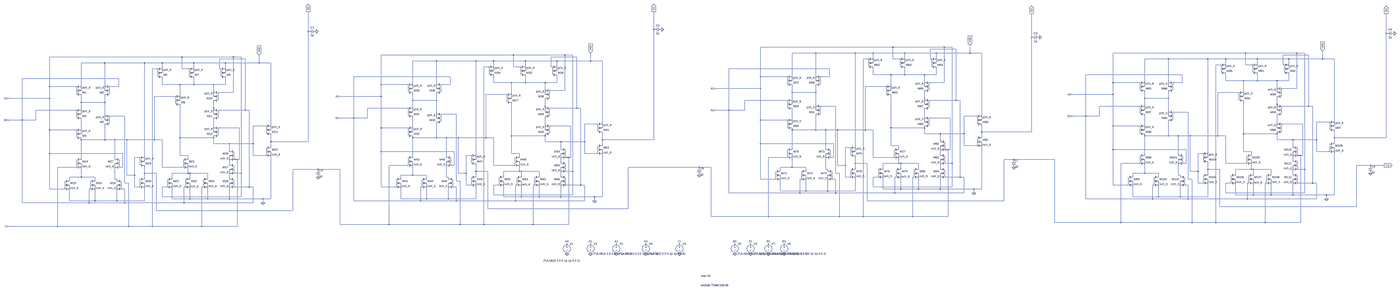
[diagram p0: schematic design_1.asc, whole sheet]
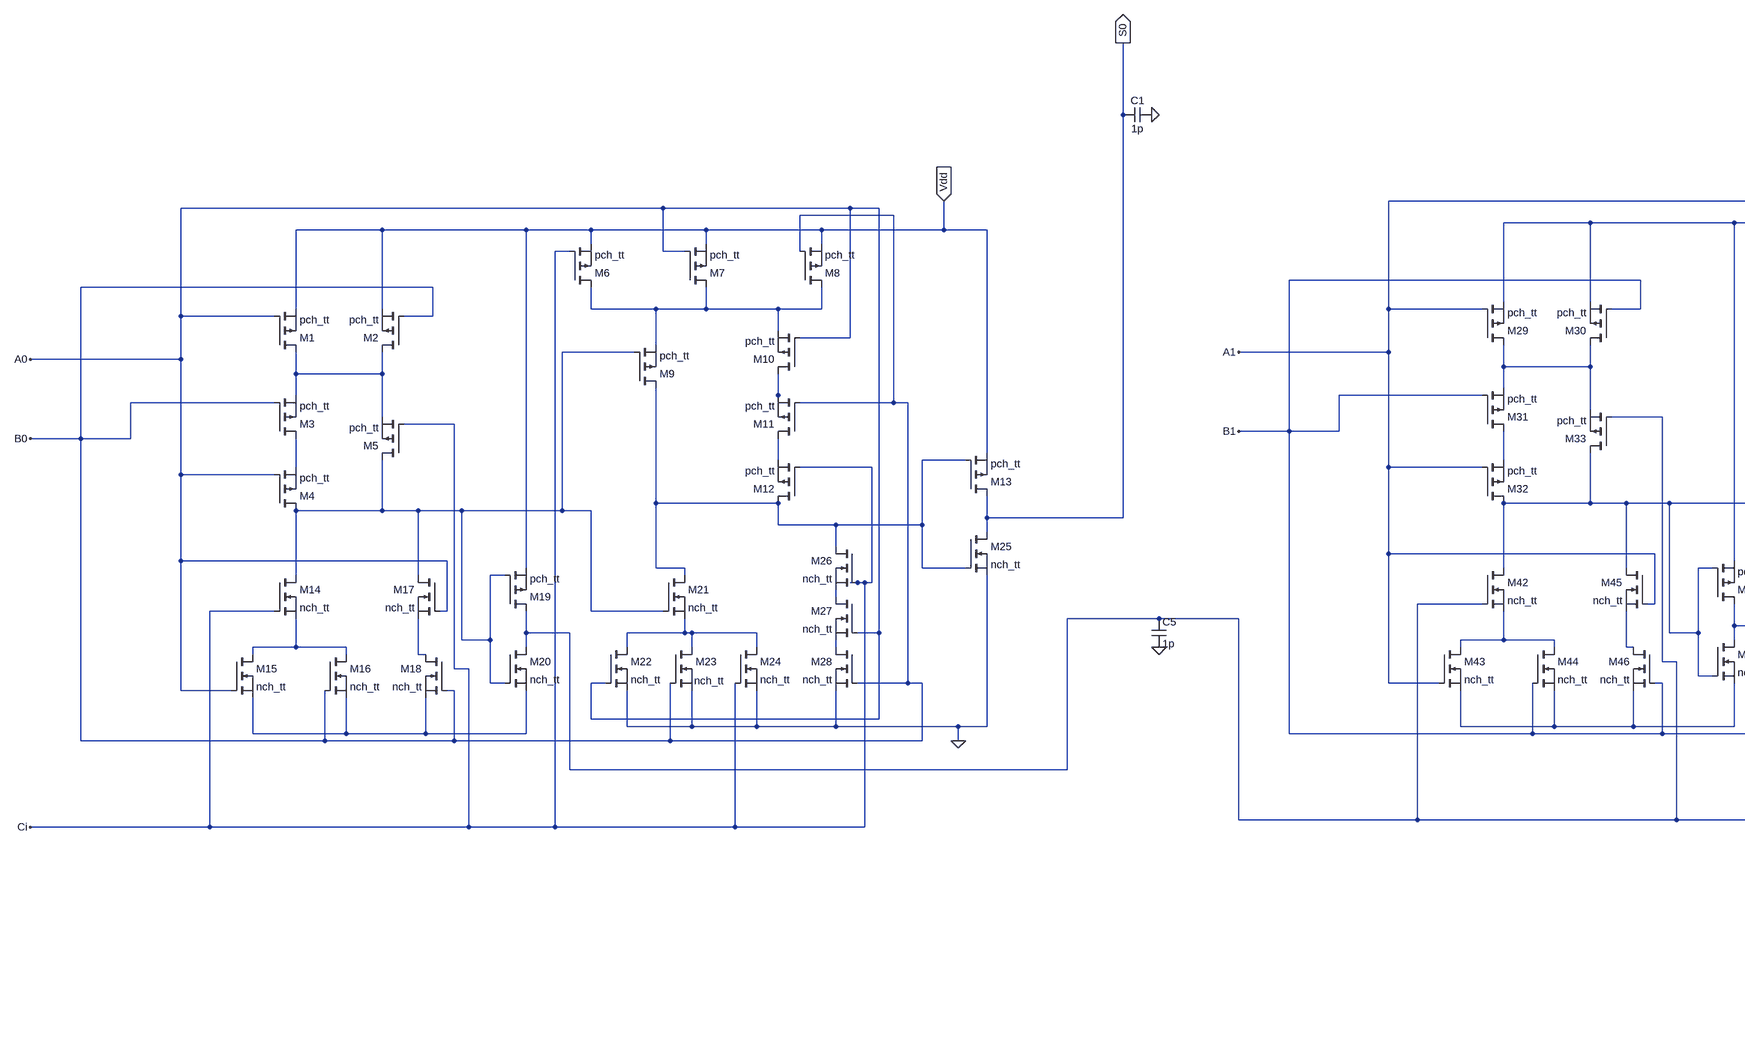
[diagram p1: schematic design_1.asc, part, row 1 of 1, column 1 of 3]
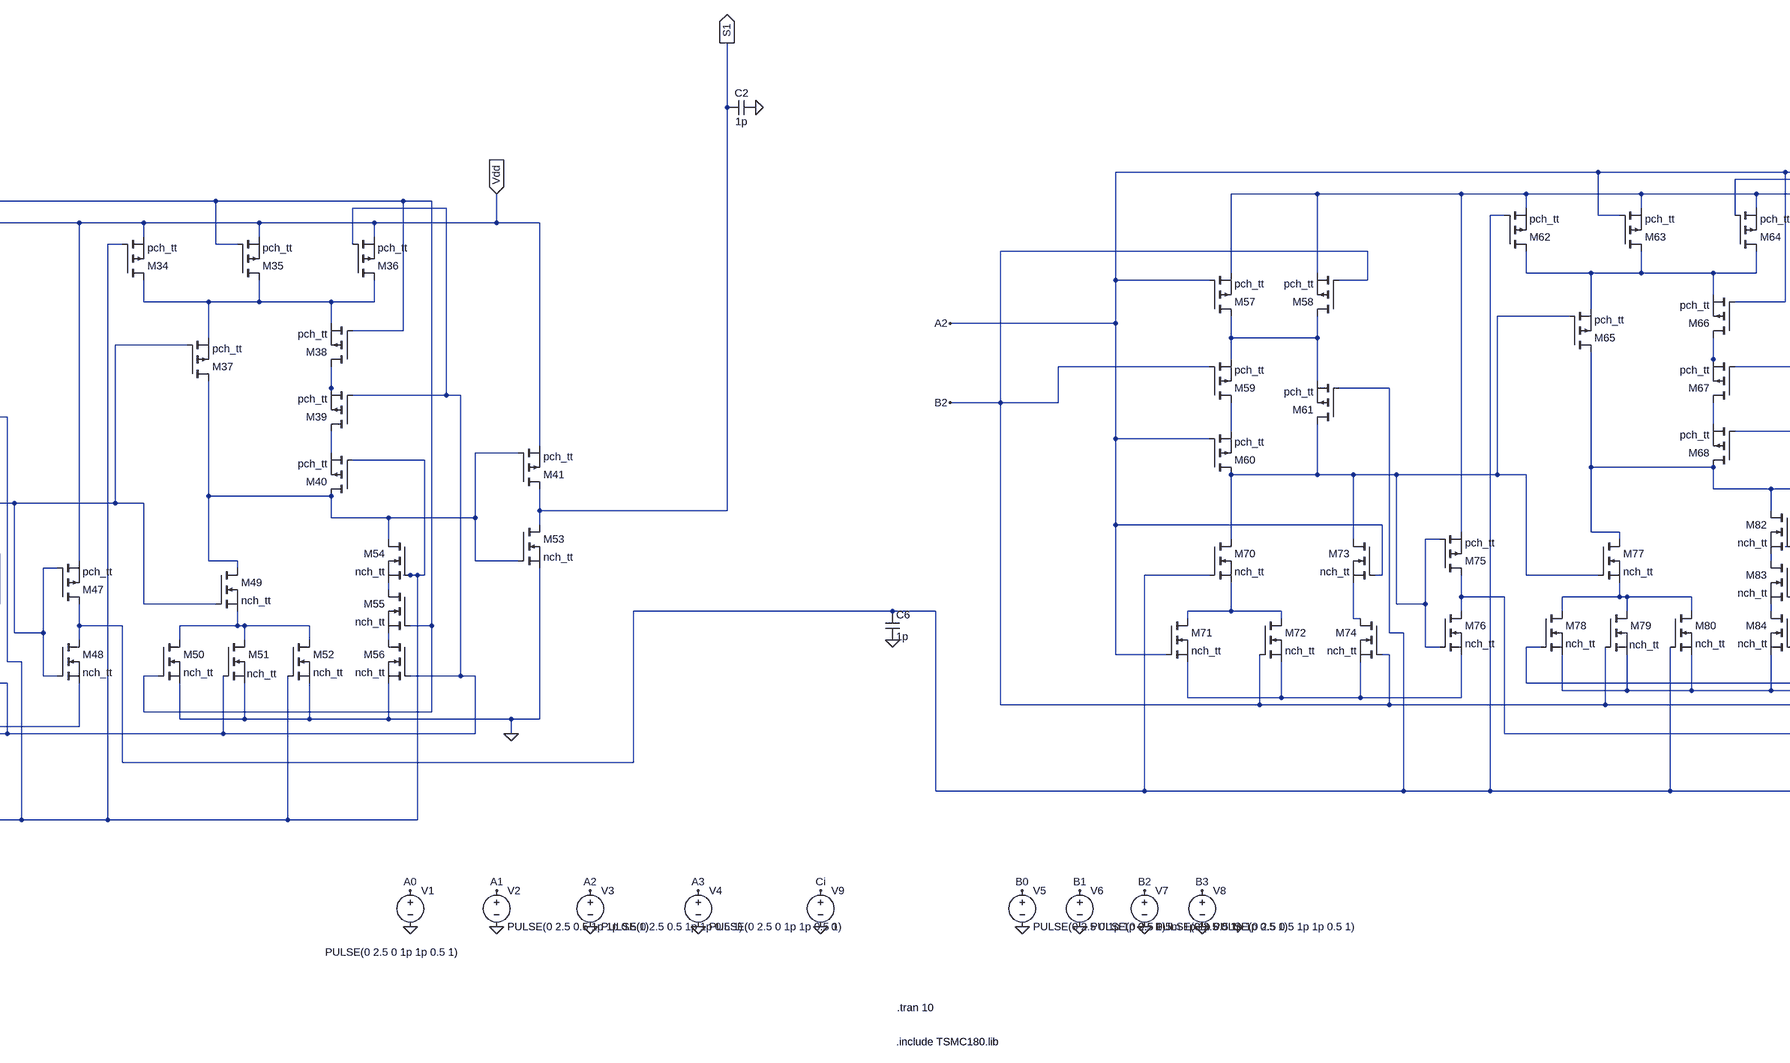
[diagram p2: schematic design_1.asc, part, row 1 of 1, column 2 of 3]
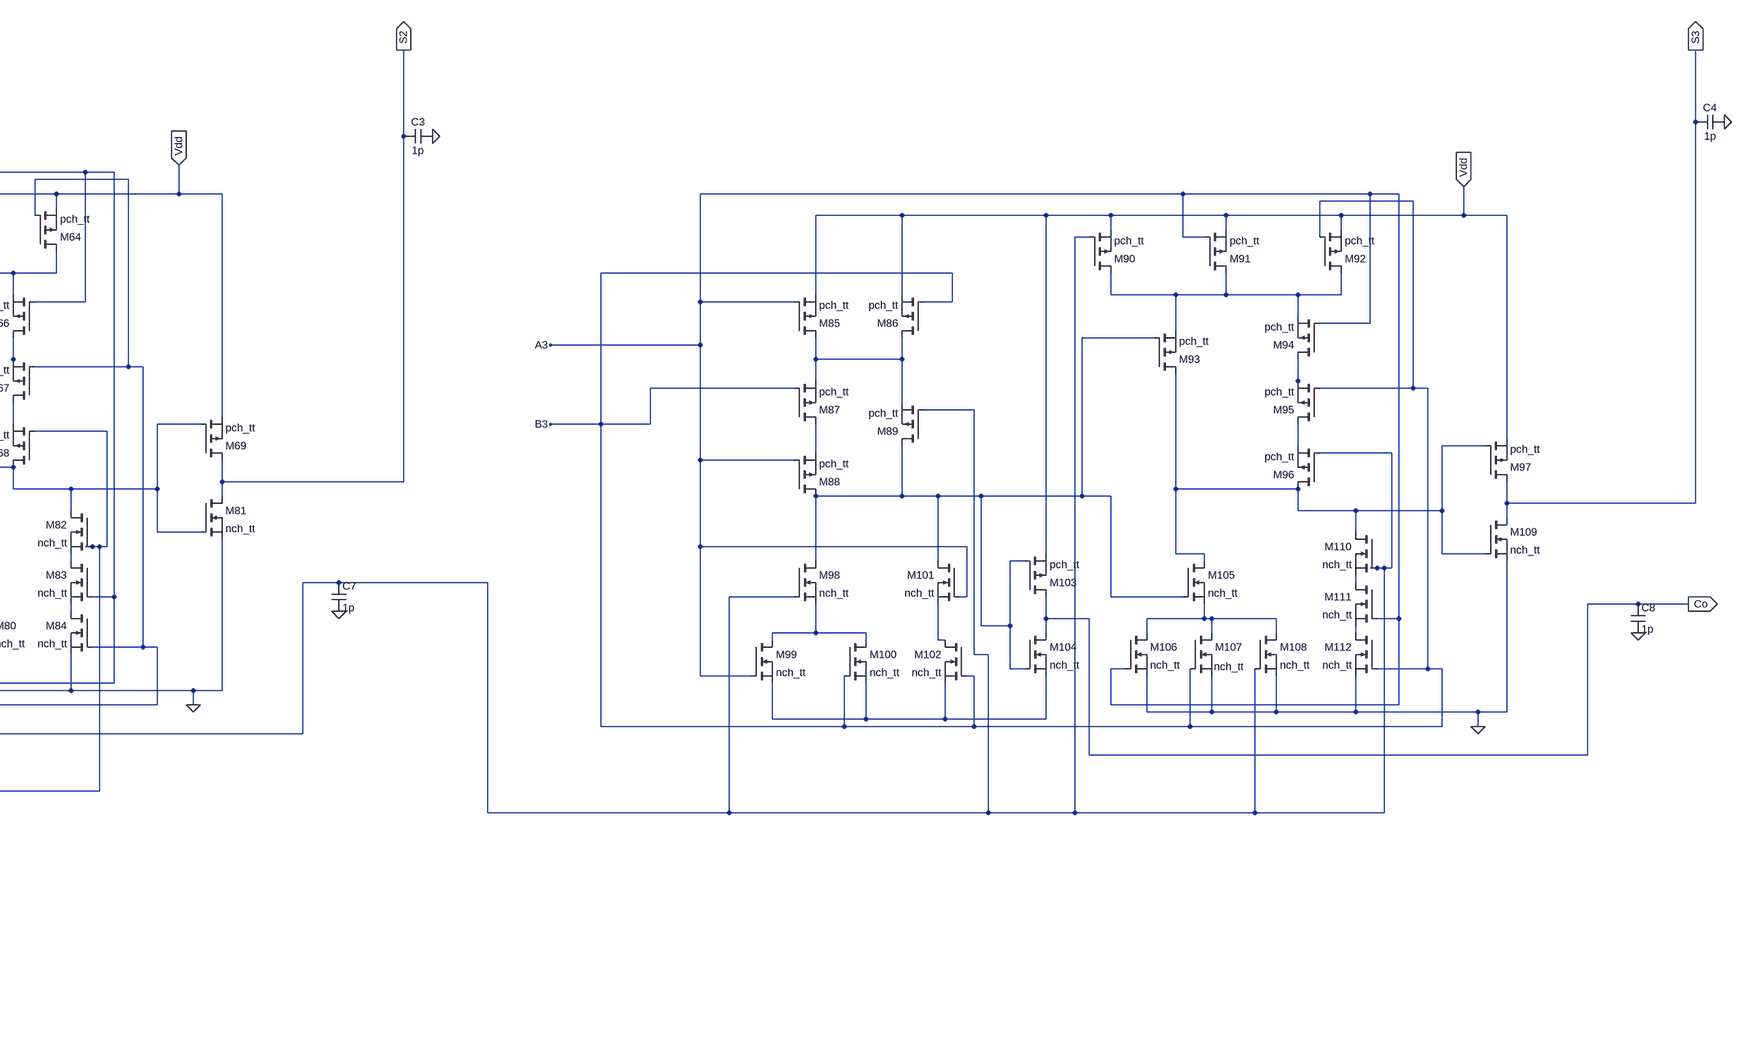
[diagram p3: schematic design_1.asc, part, row 1 of 1, column 3 of 3]
design_1.asc, the LTspice schematic file:
Version 4
SHEET 1 11268 1596
WIRE 5040 -912 5040 -1056
WIRE 2080 -896 2080 -1056
WIRE 11184 -880 11184 -1040
WIRE 8128 -848 8128 -1040
WIRE 6976 -768 5904 -768
WIRE 7392 -768 6976 -768
WIRE 7456 -768 7392 -768
WIRE 7488 -752 7280 -752
WIRE 6352 -720 6160 -720
WIRE 6672 -720 6352 -720
WIRE 6816 -720 6672 -720
WIRE 7072 -720 6816 -720
WIRE 7328 -720 7072 -720
WIRE 7600 -720 7600 -784
WIRE 7600 -720 7328 -720
WIRE 7696 -720 7600 -720
WIRE 10016 -720 8944 -720
WIRE 10432 -720 10016 -720
WIRE 10496 -720 10432 -720
WIRE 3904 -704 2832 -704
WIRE 4320 -704 3904 -704
WIRE 4384 -704 4320 -704
WIRE 10528 -704 10320 -704
WIRE 928 -688 -144 -688
WIRE 1344 -688 928 -688
WIRE 1408 -688 1344 -688
WIRE 4416 -688 4208 -688
WIRE 6816 -688 6816 -720
WIRE 7072 -688 7072 -720
WIRE 7328 -688 7328 -720
WIRE 1440 -672 1232 -672
WIRE 6768 -672 6736 -672
WIRE 6976 -672 6976 -768
WIRE 7024 -672 6976 -672
WIRE 7280 -672 7280 -752
WIRE 9392 -672 9200 -672
WIRE 9712 -672 9392 -672
WIRE 9856 -672 9712 -672
WIRE 10112 -672 9856 -672
WIRE 10368 -672 10112 -672
WIRE 10640 -672 10640 -736
WIRE 10640 -672 10368 -672
WIRE 10736 -672 10640 -672
WIRE 3280 -656 3088 -656
WIRE 3600 -656 3280 -656
WIRE 3744 -656 3600 -656
WIRE 4000 -656 3744 -656
WIRE 4256 -656 4000 -656
WIRE 4528 -656 4528 -720
WIRE 4528 -656 4256 -656
WIRE 4624 -656 4528 -656
WIRE 304 -640 112 -640
WIRE 624 -640 304 -640
WIRE 768 -640 624 -640
WIRE 1024 -640 768 -640
WIRE 1280 -640 1024 -640
WIRE 1552 -640 1552 -704
WIRE 1552 -640 1280 -640
WIRE 1648 -640 1552 -640
WIRE 9856 -640 9856 -672
WIRE 10112 -640 10112 -672
WIRE 10368 -640 10368 -672
WIRE 3744 -624 3744 -656
WIRE 4000 -624 4000 -656
WIRE 4256 -624 4256 -656
WIRE 9808 -624 9776 -624
WIRE 10016 -624 10016 -720
WIRE 10064 -624 10016 -624
WIRE 10320 -624 10320 -704
WIRE 768 -608 768 -640
WIRE 1024 -608 1024 -640
WIRE 1280 -608 1280 -640
WIRE 3696 -608 3664 -608
WIRE 3904 -608 3904 -704
WIRE 3952 -608 3904 -608
WIRE 4208 -608 4208 -688
WIRE 720 -592 688 -592
WIRE 928 -592 928 -688
WIRE 976 -592 928 -592
WIRE 1232 -592 1232 -672
WIRE 6464 -592 5648 -592
WIRE 6160 -544 6160 -720
WIRE 6352 -544 6352 -720
WIRE 6816 -544 6816 -592
WIRE 6960 -544 6816 -544
WIRE 7072 -544 7072 -592
WIRE 7072 -544 6960 -544
WIRE 7232 -544 7072 -544
WIRE 7328 -544 7328 -592
WIRE 7328 -544 7232 -544
WIRE 9504 -544 8688 -544
WIRE 3392 -528 2576 -528
WIRE 5904 -528 5904 -768
WIRE 6112 -528 5904 -528
WIRE 6464 -528 6464 -592
WIRE 6464 -528 6400 -528
WIRE 416 -512 -400 -512
WIRE 7232 -496 7232 -544
WIRE 9200 -496 9200 -672
WIRE 9392 -496 9392 -672
WIRE 9856 -496 9856 -544
WIRE 10000 -496 9856 -496
WIRE 10112 -496 10112 -544
WIRE 10112 -496 10000 -496
WIRE 10272 -496 10112 -496
WIRE 10368 -496 10368 -544
WIRE 10368 -496 10272 -496
WIRE 3088 -480 3088 -656
WIRE 3280 -480 3280 -656
WIRE 3744 -480 3744 -528
WIRE 3888 -480 3744 -480
WIRE 4000 -480 4000 -528
WIRE 4000 -480 3888 -480
WIRE 4160 -480 4000 -480
WIRE 4256 -480 4256 -528
WIRE 4256 -480 4160 -480
WIRE 7392 -480 7392 -768
WIRE 7392 -480 7280 -480
WIRE 8944 -480 8944 -720
WIRE 9152 -480 8944 -480
WIRE 9504 -480 9504 -544
WIRE 9504 -480 9440 -480
WIRE 112 -464 112 -640
WIRE 304 -464 304 -640
WIRE 768 -464 768 -512
WIRE 912 -464 768 -464
WIRE 1024 -464 1024 -512
WIRE 1024 -464 912 -464
WIRE 1184 -464 1024 -464
WIRE 1280 -464 1280 -512
WIRE 1280 -464 1184 -464
WIRE 2832 -464 2832 -704
WIRE 3040 -464 2832 -464
WIRE 3392 -464 3392 -528
WIRE 3392 -464 3328 -464
WIRE 6960 -464 6960 -544
WIRE -144 -448 -144 -688
WIRE 64 -448 -144 -448
WIRE 416 -448 416 -512
WIRE 416 -448 352 -448
WIRE 6912 -448 6752 -448
WIRE 10272 -448 10272 -496
WIRE 4160 -432 4160 -480
WIRE 5904 -432 5904 -528
WIRE 5904 -432 5536 -432
WIRE 10432 -432 10432 -720
WIRE 10432 -432 10320 -432
WIRE 1184 -416 1184 -464
WIRE 4320 -416 4320 -704
WIRE 4320 -416 4208 -416
WIRE 10000 -416 10000 -496
WIRE 1344 -400 1344 -688
WIRE 1344 -400 1232 -400
WIRE 3888 -400 3888 -480
WIRE 6160 -400 6160 -448
WIRE 6352 -400 6352 -448
WIRE 6352 -400 6160 -400
WIRE 9952 -400 9792 -400
WIRE 912 -384 912 -464
WIRE 3840 -384 3680 -384
WIRE 8944 -384 8944 -480
WIRE 8944 -384 8576 -384
WIRE 864 -368 704 -368
WIRE 2832 -368 2832 -464
WIRE 2832 -368 2464 -368
WIRE -144 -352 -144 -448
WIRE -144 -352 -512 -352
WIRE 6160 -352 6160 -400
WIRE 7232 -352 7232 -400
WIRE 9200 -352 9200 -400
WIRE 9392 -352 9392 -400
WIRE 9392 -352 9200 -352
WIRE 3088 -336 3088 -384
WIRE 3280 -336 3280 -384
WIRE 3280 -336 3088 -336
WIRE 6112 -336 5776 -336
WIRE 7232 -336 7232 -352
WIRE 7488 -336 7488 -752
WIRE 7488 -336 7280 -336
WIRE 7520 -336 7488 -336
WIRE 112 -320 112 -368
WIRE 304 -320 304 -368
WIRE 304 -320 112 -320
WIRE 6352 -304 6352 -400
WIRE 9200 -304 9200 -352
WIRE 10272 -304 10272 -352
WIRE 3088 -288 3088 -336
WIRE 4160 -288 4160 -336
WIRE 6512 -288 6400 -288
WIRE 9152 -288 8816 -288
WIRE 10272 -288 10272 -304
WIRE 10528 -288 10528 -704
WIRE 10528 -288 10320 -288
WIRE 10560 -288 10528 -288
WIRE 112 -272 112 -320
WIRE 1184 -272 1184 -320
WIRE 3040 -272 2704 -272
WIRE 4160 -272 4160 -288
WIRE 4416 -272 4416 -688
WIRE 4416 -272 4208 -272
WIRE 4448 -272 4416 -272
WIRE 64 -256 -272 -256
WIRE 1184 -256 1184 -272
WIRE 1440 -256 1440 -672
WIRE 1440 -256 1232 -256
WIRE 1472 -256 1440 -256
WIRE 5648 -256 5648 -592
WIRE 5648 -256 5536 -256
WIRE 5776 -256 5776 -336
WIRE 5776 -256 5648 -256
WIRE 9392 -256 9392 -352
WIRE 3280 -240 3280 -336
WIRE 9552 -240 9440 -240
WIRE 304 -224 304 -320
WIRE 3440 -224 3328 -224
WIRE 7696 -224 7696 -720
WIRE 464 -208 352 -208
WIRE 7232 -208 7232 -256
WIRE 7648 -208 7552 -208
WIRE 8688 -208 8688 -544
WIRE 8688 -208 8576 -208
WIRE 8816 -208 8816 -288
WIRE 8816 -208 8688 -208
WIRE 2576 -192 2576 -528
WIRE 2576 -192 2464 -192
WIRE 2704 -192 2704 -272
WIRE 2704 -192 2576 -192
WIRE 6160 -192 6160 -256
WIRE 7440 -192 7280 -192
WIRE -400 -176 -400 -512
WIRE -400 -176 -512 -176
WIRE -272 -176 -272 -256
WIRE -272 -176 -400 -176
WIRE 5904 -176 5904 -432
WIRE 6112 -176 5904 -176
WIRE 10736 -176 10736 -672
WIRE 4624 -160 4624 -656
WIRE 10272 -160 10272 -208
WIRE 10688 -160 10592 -160
WIRE 1648 -144 1648 -640
WIRE 4160 -144 4160 -192
WIRE 4576 -144 4480 -144
WIRE 9200 -144 9200 -208
WIRE 10480 -144 10320 -144
WIRE 1184 -128 1184 -176
WIRE 1600 -128 1504 -128
WIRE 3088 -128 3088 -192
WIRE 4368 -128 4208 -128
WIRE 8944 -128 8944 -384
WIRE 9152 -128 8944 -128
WIRE 112 -112 112 -176
WIRE 1392 -112 1232 -112
WIRE 2832 -112 2832 -368
WIRE 3040 -112 2832 -112
WIRE 6960 -112 6960 -368
WIRE 7232 -112 6960 -112
WIRE -144 -96 -144 -352
WIRE 64 -96 -144 -96
WIRE 6352 -96 6352 -208
WIRE 6352 -96 6160 -96
WIRE 6432 -96 6352 -96
WIRE 6528 -96 6432 -96
WIRE 6752 -96 6752 -448
WIRE 6752 -96 6528 -96
WIRE 6816 -96 6752 -96
WIRE 7696 -80 7696 -128
WIRE 8128 -80 8128 -848
WIRE 8128 -80 7696 -80
WIRE 7232 -64 7232 -112
WIRE 7360 -64 7232 -64
WIRE 7552 -64 7552 -208
WIRE 7552 -64 7360 -64
WIRE 10000 -64 10000 -320
WIRE 10272 -64 10000 -64
WIRE 3888 -48 3888 -304
WIRE 4160 -48 3888 -48
WIRE 7696 -48 7696 -80
WIRE 9392 -48 9392 -160
WIRE 9392 -48 9200 -48
WIRE 9472 -48 9392 -48
WIRE 9568 -48 9472 -48
WIRE 9792 -48 9792 -400
WIRE 9792 -48 9568 -48
WIRE 9856 -48 9792 -48
WIRE 912 -32 912 -288
WIRE 1184 -32 912 -32
WIRE 3280 -32 3280 -144
WIRE 3280 -32 3088 -32
WIRE 3360 -32 3280 -32
WIRE 3456 -32 3360 -32
WIRE 3680 -32 3680 -384
WIRE 3680 -32 3456 -32
WIRE 3744 -32 3680 -32
WIRE 10736 -32 10736 -80
WIRE 11184 -32 11184 -880
WIRE 11184 -32 10736 -32
WIRE 304 -16 304 -128
WIRE 304 -16 112 -16
WIRE 384 -16 304 -16
WIRE 480 -16 384 -16
WIRE 704 -16 704 -368
WIRE 704 -16 480 -16
WIRE 768 -16 704 -16
WIRE 4624 -16 4624 -64
WIRE 5040 -16 5040 -912
WIRE 5040 -16 4624 -16
WIRE 7360 -16 7360 -64
WIRE 10272 -16 10272 -64
WIRE 10400 -16 10272 -16
WIRE 10592 -16 10592 -160
WIRE 10592 -16 10400 -16
WIRE 1648 0 1648 -48
WIRE 2080 0 2080 -896
WIRE 2080 0 1648 0
WIRE 4160 0 4160 -48
WIRE 4288 0 4160 0
WIRE 4480 0 4480 -144
WIRE 4480 0 4288 0
WIRE 10736 0 10736 -32
WIRE 1184 16 1184 -32
WIRE 1312 16 1184 16
WIRE 1504 16 1504 -128
WIRE 1504 16 1312 16
WIRE 4624 16 4624 -16
WIRE 5904 16 5904 -176
WIRE 6496 16 5904 16
WIRE 1648 32 1648 0
WIRE 6672 32 6672 -720
WIRE 6960 32 6960 -112
WIRE 7024 32 6960 32
WIRE 7552 32 7552 -64
WIRE 7648 32 7552 32
WIRE 10400 32 10400 -16
WIRE 4288 48 4288 0
WIRE 6160 48 6160 -96
WIRE 6432 48 6432 -96
WIRE 6624 48 6592 48
WIRE 7024 48 7024 32
WIRE 1312 64 1312 16
WIRE 7408 64 7392 64
WIRE 7424 64 7408 64
WIRE 7440 64 7440 -192
WIRE 7440 64 7424 64
WIRE 8944 64 8944 -128
WIRE 9536 64 8944 64
WIRE 2832 80 2832 -112
WIRE 3424 80 2832 80
WIRE 9712 80 9712 -672
WIRE 10000 80 10000 -64
WIRE 10064 80 10000 80
WIRE 10592 80 10592 -16
WIRE 10688 80 10592 80
WIRE -144 96 -144 -96
WIRE 448 96 -144 96
WIRE 3600 96 3600 -656
WIRE 3888 96 3888 -48
WIRE 3952 96 3888 96
WIRE 4480 96 4480 0
WIRE 4576 96 4480 96
WIRE 7360 96 7360 80
WIRE 9200 96 9200 -48
WIRE 9472 96 9472 -48
WIRE 9664 96 9632 96
WIRE 10064 96 10064 80
WIRE 624 112 624 -640
WIRE 912 112 912 -32
WIRE 976 112 912 112
WIRE 1504 112 1504 16
WIRE 1600 112 1504 112
WIRE 3088 112 3088 -32
WIRE 3360 112 3360 -32
WIRE 3552 112 3520 112
WIRE 3952 112 3952 96
WIRE 10448 112 10432 112
WIRE 10464 112 10448 112
WIRE 10480 112 10480 -144
WIRE 10480 112 10464 112
WIRE 112 128 112 -16
WIRE 384 128 384 -16
WIRE 576 128 544 128
WIRE 976 128 976 112
WIRE 4336 128 4320 128
WIRE 4352 128 4336 128
WIRE 4368 128 4368 -128
WIRE 4368 128 4352 128
WIRE 6112 128 5968 128
WIRE 6496 128 6496 16
WIRE 6496 128 6480 128
WIRE 6816 128 6816 -96
WIRE 6976 128 6816 128
WIRE 1360 144 1344 144
WIRE 1376 144 1360 144
WIRE 1392 144 1392 -112
WIRE 1392 144 1376 144
WIRE 7984 144 7904 144
WIRE 8416 144 7984 144
WIRE 10400 144 10400 128
WIRE 4288 160 4288 144
WIRE 1312 176 1312 160
WIRE 6672 176 6672 128
WIRE 6768 176 6672 176
WIRE 7024 176 7024 144
WIRE 7024 176 6896 176
WIRE 7040 176 7024 176
WIRE 7184 176 7040 176
WIRE 7456 176 7456 -768
WIRE 7456 176 7408 176
WIRE 9152 176 9008 176
WIRE 9536 176 9536 64
WIRE 9536 176 9520 176
WIRE 9856 176 9856 -48
WIRE 10016 176 9856 176
WIRE 3040 192 2896 192
WIRE 3424 192 3424 80
WIRE 3424 192 3408 192
WIRE 3744 192 3744 -32
WIRE 3904 192 3744 192
WIRE 6528 192 6528 -96
WIRE 6592 192 6592 48
WIRE 6592 192 6528 192
WIRE 11056 192 10944 192
WIRE 11168 192 11056 192
WIRE 64 208 -80 208
WIRE 448 208 448 96
WIRE 448 208 432 208
WIRE 768 208 768 -16
WIRE 928 208 768 208
WIRE 5408 208 4832 208
WIRE 5504 208 5408 208
WIRE 6160 208 6160 144
WIRE 6160 208 6064 208
WIRE 6272 208 6160 208
WIRE 6672 208 6672 176
WIRE 6896 208 6896 176
WIRE 7040 208 7040 176
WIRE 7184 208 7184 176
WIRE 7360 208 7360 192
WIRE 2160 224 1856 224
WIRE 2464 224 2160 224
WIRE 6064 224 6064 208
WIRE 6272 224 6272 208
WIRE 6432 224 6432 144
WIRE 6448 224 6432 224
WIRE 9712 224 9712 176
WIRE 9808 224 9712 224
WIRE 10064 224 10064 192
WIRE 10064 224 9936 224
WIRE 10080 224 10064 224
WIRE 10224 224 10080 224
WIRE 10496 224 10496 -720
WIRE 10496 224 10448 224
WIRE 3600 240 3600 192
WIRE 3696 240 3600 240
WIRE 3952 240 3952 208
WIRE 3952 240 3824 240
WIRE 3968 240 3952 240
WIRE 4112 240 3968 240
WIRE 4384 240 4384 -704
WIRE 4384 240 4336 240
WIRE 9568 240 9568 -48
WIRE 9632 240 9632 96
WIRE 9632 240 9568 240
WIRE 624 256 624 208
WIRE 720 256 624 256
WIRE 976 256 976 224
WIRE 976 256 848 256
WIRE 992 256 976 256
WIRE 1136 256 992 256
WIRE 1408 256 1408 -688
WIRE 1408 256 1360 256
WIRE 3456 256 3456 -32
WIRE 3520 256 3520 112
WIRE 3520 256 3456 256
WIRE 6512 256 6512 -288
WIRE 6544 256 6512 256
WIRE 9200 256 9200 192
WIRE 9200 256 9104 256
WIRE 9312 256 9200 256
WIRE 9712 256 9712 224
WIRE 9936 256 9936 224
WIRE 10080 256 10080 224
WIRE 10224 256 10224 224
WIRE 10400 256 10400 240
WIRE 480 272 480 -16
WIRE 544 272 544 128
WIRE 544 272 480 272
WIRE 3088 272 3088 208
WIRE 3088 272 2992 272
WIRE 3200 272 3088 272
WIRE 3600 272 3600 240
WIRE 3824 272 3824 240
WIRE 3968 272 3968 240
WIRE 4112 272 4112 240
WIRE 4288 272 4288 256
WIRE 9104 272 9104 256
WIRE 9312 272 9312 256
WIRE 9472 272 9472 192
WIRE 9488 272 9472 272
WIRE 112 288 112 224
WIRE 112 288 16 288
WIRE 224 288 112 288
WIRE 624 288 624 256
WIRE 848 288 848 256
WIRE 992 288 992 256
WIRE 1136 288 1136 256
WIRE 1312 288 1312 272
WIRE 2992 288 2992 272
WIRE 3200 288 3200 272
WIRE 3360 288 3360 208
WIRE 3376 288 3360 288
WIRE 6592 288 6592 192
WIRE 6624 288 6592 288
WIRE 6848 288 6816 288
WIRE 7520 288 7520 -336
WIRE 7520 288 7408 288
WIRE 7552 288 7520 288
WIRE 16 304 16 288
WIRE 224 304 224 288
WIRE 384 304 384 224
WIRE 400 304 384 304
WIRE 5904 304 5904 16
WIRE 6016 304 5904 304
WIRE 6512 304 6496 304
WIRE 9552 304 9552 -240
WIRE 9584 304 9552 304
WIRE 3440 320 3440 -224
WIRE 3472 320 3440 320
WIRE 464 336 464 -208
WIRE 496 336 464 336
WIRE 9632 336 9632 240
WIRE 9664 336 9632 336
WIRE 9888 336 9856 336
WIRE 10560 336 10560 -288
WIRE 10560 336 10448 336
WIRE 10592 336 10560 336
WIRE 3520 352 3520 256
WIRE 3552 352 3520 352
WIRE 3776 352 3744 352
WIRE 4448 352 4448 -272
WIRE 4448 352 4336 352
WIRE 4480 352 4448 352
WIRE 8944 352 8944 64
WIRE 9056 352 8944 352
WIRE 9552 352 9536 352
WIRE 544 368 544 272
WIRE 576 368 544 368
WIRE 800 368 768 368
WIRE 1472 368 1472 -256
WIRE 1472 368 1360 368
WIRE 1504 368 1472 368
WIRE 2832 368 2832 80
WIRE 2944 368 2832 368
WIRE 3440 368 3424 368
WIRE 6816 368 6816 288
WIRE 7456 368 7456 176
WIRE 7456 368 6816 368
WIRE -144 384 -144 96
WIRE -32 384 -144 384
WIRE 464 384 448 384
WIRE 6896 384 6896 304
WIRE 7040 384 7040 304
WIRE 7040 384 6896 384
WIRE 7184 384 7184 304
WIRE 7184 384 7040 384
WIRE 7360 384 7360 304
WIRE 7360 384 7184 384
WIRE 7632 384 7360 384
WIRE 7696 384 7696 48
WIRE 7696 384 7632 384
WIRE 6064 400 6064 320
WIRE 6272 400 6272 320
WIRE 6272 400 6064 400
WIRE 6448 400 6448 320
WIRE 6448 400 6272 400
WIRE 6672 400 6672 304
WIRE 6672 400 6448 400
WIRE 5648 416 5648 -256
WIRE 6224 416 6224 304
WIRE 6224 416 5648 416
WIRE 6512 416 6512 304
WIRE 6512 416 6224 416
WIRE 6992 416 6992 288
WIRE 6992 416 6512 416
WIRE 7552 416 7552 288
WIRE 7552 416 6992 416
WIRE 7632 416 7632 384
WIRE 9856 416 9856 336
WIRE 10496 416 10496 224
WIRE 10496 416 9856 416
WIRE 3744 432 3744 352
WIRE 4384 432 4384 240
WIRE 4384 432 3744 432
WIRE 9936 432 9936 352
WIRE 10080 432 10080 352
WIRE 10080 432 9936 432
WIRE 10224 432 10224 352
WIRE 10224 432 10080 432
WIRE 10400 432 10400 352
WIRE 10400 432 10224 432
WIRE 10672 432 10400 432
WIRE 10736 432 10736 96
WIRE 10736 432 10672 432
WIRE 768 448 768 368
WIRE 1408 448 1408 256
WIRE 1408 448 768 448
WIRE 3824 448 3824 368
WIRE 3968 448 3968 368
WIRE 3968 448 3824 448
WIRE 4112 448 4112 368
WIRE 4112 448 3968 448
WIRE 4288 448 4288 368
WIRE 4288 448 4112 448
WIRE 4560 448 4288 448
WIRE 4624 448 4624 112
WIRE 4624 448 4560 448
WIRE 9104 448 9104 368
WIRE 9312 448 9312 368
WIRE 9312 448 9104 448
WIRE 9488 448 9488 368
WIRE 9488 448 9312 448
WIRE 9712 448 9712 352
WIRE 9712 448 9488 448
WIRE 848 464 848 384
WIRE 992 464 992 384
WIRE 992 464 848 464
WIRE 1136 464 1136 384
WIRE 1136 464 992 464
WIRE 1312 464 1312 384
WIRE 1312 464 1136 464
WIRE 1584 464 1312 464
WIRE 1648 464 1648 128
WIRE 1648 464 1584 464
WIRE 2992 464 2992 384
WIRE 3200 464 3200 384
WIRE 3200 464 2992 464
WIRE 3376 464 3376 384
WIRE 3376 464 3200 464
WIRE 3600 464 3600 368
WIRE 3600 464 3376 464
WIRE 8688 464 8688 -208
WIRE 9264 464 9264 352
WIRE 9264 464 8688 464
WIRE 9552 464 9552 352
WIRE 9552 464 9264 464
WIRE 10032 464 10032 336
WIRE 10032 464 9552 464
WIRE 10592 464 10592 336
WIRE 10592 464 10032 464
WIRE 10672 464 10672 432
WIRE 16 480 16 400
WIRE 224 480 224 400
WIRE 224 480 16 480
WIRE 400 480 400 400
WIRE 400 480 224 480
WIRE 624 480 624 384
WIRE 624 480 400 480
WIRE 2576 480 2576 -192
WIRE 3152 480 3152 368
WIRE 3152 480 2576 480
WIRE 3440 480 3440 368
WIRE 3440 480 3152 480
WIRE 3920 480 3920 352
WIRE 3920 480 3440 480
WIRE 4480 480 4480 352
WIRE 4480 480 3920 480
WIRE 4560 480 4560 448
WIRE 6768 480 6768 176
WIRE 7904 480 7904 144
WIRE 7904 480 6768 480
WIRE -400 496 -400 -176
WIRE 176 496 176 384
WIRE 176 496 -400 496
WIRE 464 496 464 384
WIRE 464 496 176 496
WIRE 944 496 944 368
WIRE 944 496 464 496
WIRE 1504 496 1504 368
WIRE 1504 496 944 496
WIRE 1584 496 1584 464
WIRE 9808 528 9808 224
WIRE 10944 528 10944 192
WIRE 10944 528 9808 528
WIRE 3696 544 3696 240
WIRE 4832 544 4832 208
WIRE 4832 544 3696 544
WIRE 720 560 720 256
WIRE 1856 560 1856 224
WIRE 1856 560 720 560
WIRE 5504 608 5504 208
WIRE 5968 608 5968 128
WIRE 5968 608 5504 608
WIRE 6544 608 6544 256
WIRE 6544 608 5968 608
WIRE 6736 608 6736 -672
WIRE 6736 608 6544 608
WIRE 7136 608 7136 288
WIRE 7136 608 6736 608
WIRE 7424 608 7424 64
WIRE 7424 608 7136 608
WIRE 8416 656 8416 144
WIRE 9008 656 9008 176
WIRE 9008 656 8416 656
WIRE 9584 656 9584 304
WIRE 9584 656 9008 656
WIRE 9776 656 9776 -624
WIRE 9776 656 9584 656
WIRE 10176 656 10176 336
WIRE 10176 656 9776 656
WIRE 10464 656 10464 112
WIRE 10464 656 10176 656
WIRE 2464 672 2464 224
WIRE 2896 672 2896 192
WIRE 2896 672 2464 672
WIRE 3472 672 3472 320
WIRE 3472 672 2896 672
WIRE 3664 672 3664 -608
WIRE 3664 672 3472 672
WIRE 4064 672 4064 352
WIRE 4064 672 3664 672
WIRE 4352 672 4352 128
WIRE 4352 672 4064 672
WIRE -80 688 -80 208
WIRE -80 688 -512 688
WIRE 496 688 496 336
WIRE 496 688 -80 688
WIRE 688 688 688 -592
WIRE 688 688 496 688
WIRE 1088 688 1088 368
WIRE 1088 688 688 688
WIRE 1376 688 1376 144
WIRE 1376 688 1088 688
FLAG 1552 -704 Vdd
IOPIN 1552 -704 In
FLAG 1584 496 0
FLAG 4528 -720 Vdd
IOPIN 4528 -720 In
FLAG 4560 480 0
FLAG 7600 -784 Vdd
IOPIN 7600 -784 In
FLAG 7632 416 0
FLAG 10640 -736 Vdd
IOPIN 10640 -736 In
FLAG 10672 464 0
FLAG 2080 -1056 S0
IOPIN 2080 -1056 Out
FLAG 5040 -1056 S1
IOPIN 5040 -1056 Out
FLAG 8128 -1040 S2
IOPIN 8128 -1040 Out
FLAG 11184 -1040 S3
IOPIN 11184 -1040 Out
FLAG 11168 192 Co
IOPIN 11168 192 Out
FLAG 4336 1184 0
FLAG 4528 1184 0
FLAG 4736 1184 0
FLAG 4976 1184 0
FLAG 5696 1184 0
FLAG 5824 1184 0
FLAG 5968 1184 0
FLAG 6096 1184 0
FLAG 4336 1104 A0
FLAG -512 -352 A0
FLAG 4528 1104 A1
FLAG 2464 -368 A1
FLAG 4736 1104 A2
FLAG 5536 -432 A2
FLAG 4976 1104 A3
FLAG 8576 -384 A3
FLAG 5696 1104 B0
FLAG 5824 1104 B1
FLAG 5968 1104 B2
FLAG 6096 1104 B3
FLAG -512 -176 B0
FLAG 2464 -192 B1
FLAG 5536 -256 B2
FLAG 8576 -208 B3
FLAG 5248 1184 0
FLAG 5248 1104 Ci
FLAG -512 688 Ci
FLAG 2144 -896 0
FLAG 5104 -912 0
FLAG 8192 -848 0
FLAG 11248 -880 0
FLAG 2160 288 0
FLAG 5408 272 0
FLAG 7984 208 0
FLAG 11056 256 0
SYMBOL pmos 64 -368 M180
SYMATTR InstName M1
SYMATTR Value pch_tt
SYMATTR Value2 W=720n,L=180n
SYMBOL pmos 352 -368 R180
SYMATTR InstName M2
SYMATTR Value pch_tt
SYMATTR Value2 W=720n,L=180n
SYMBOL pmos 64 -176 M180
SYMATTR InstName M3
SYMATTR Value pch_tt
SYMATTR Value2 W=1440n,L=180n
SYMBOL pmos 64 -16 M180
SYMATTR InstName M4
SYMATTR Value pch_tt
SYMATTR Value2 W=1440n,L=180n
SYMBOL pmos 352 -128 R180
SYMATTR InstName M5
SYMATTR Value pch_tt
SYMATTR Value2 W=720n,L=180n
SYMBOL pmos 720 -512 M180
SYMATTR InstName M6
SYMATTR Value pch_tt
SYMATTR Value2 W=720n,L=180n
SYMBOL pmos 976 -512 M180
SYMATTR InstName M7
SYMATTR Value pch_tt
SYMATTR Value2 W=720n,L=180n
SYMBOL pmos 1232 -512 M180
SYMATTR InstName M8
SYMATTR Value pch_tt
SYMATTR Value2 W=720n,L=180n
SYMBOL pmos 864 -288 M180
SYMATTR InstName M9
SYMATTR Value pch_tt
SYMATTR Value2 W=270n,L=270n
SYMBOL pmos 1232 -320 R180
SYMATTR InstName M10
SYMATTR Value pch_tt
SYMATTR Value2 W=2160n,L=180n
SYMBOL pmos 1232 -176 R180
SYMATTR InstName M11
SYMATTR Value pch_tt
SYMATTR Value2 W=2160n,L=180n
SYMBOL pmos 1232 -32 R180
SYMATTR InstName M12
SYMATTR Value pch_tt
SYMATTR Value2 W=2160n,L=180n
SYMBOL pmos 1600 -48 M180
SYMATTR InstName M13
SYMATTR Value pch_tt
SYMATTR Value2 W=360n,L=180n
SYMBOL nmos 64 128 R0
SYMATTR InstName M14
SYMATTR Value nch_tt
SYMATTR Value2 W=360n,L=180n
SYMBOL nmos -32 304 R0
SYMATTR InstName M15
SYMATTR Value nch_tt
SYMATTR Value2 W=360n,L=180n
SYMBOL nmos 176 304 R0
SYMATTR InstName M16
SYMATTR Value nch_tt
SYMATTR Value2 W=360n,L=180n
SYMBOL nmos 432 128 M0
SYMATTR InstName M17
SYMATTR Value nch_tt
SYMATTR Value2 W=360n,L=180n
SYMBOL nmos 448 304 M0
SYMATTR InstName M18
SYMATTR Value nch_tt
SYMATTR Value2 W=360n,L=180n
SYMBOL pmos 576 208 M180
SYMATTR InstName M19
SYMATTR Value pch_tt
SYMATTR Value2 W=360n,L=180n
SYMBOL nmos 576 288 R0
SYMATTR InstName M20
SYMATTR Value nch_tt
SYMATTR Value2 W=180n,L=180n
SYMBOL nmos 928 128 R0
SYMATTR InstName M21
SYMATTR Value nch_tt
SYMATTR Value2 W=360n,L=180n
SYMBOL nmos 800 288 R0
SYMATTR InstName M22
SYMATTR Value nch_tt
SYMATTR Value2 W=360n,L=180n
SYMBOL nmos 944 288 R0
WINDOW 3 53 75 Left 2
SYMATTR InstName M23
SYMATTR Value nch_tt
SYMATTR Value2 W=360n,L=180n
SYMBOL nmos 1088 288 R0
SYMATTR InstName M24
SYMATTR Value nch_tt
SYMATTR Value2 W=360n,L=180n
SYMBOL nmos 1600 32 R0
SYMATTR InstName M25
SYMATTR Value nch_tt
SYMATTR Value2 W=180n,L=180n
SYMBOL nmos 1360 64 M0
SYMATTR InstName M26
SYMATTR Value nch_tt
SYMATTR Value2 W=540n,L=180n
SYMBOL nmos 1360 176 M0
SYMATTR InstName M27
SYMATTR Value nch_tt
SYMATTR Value2 W=540n,L=180n
SYMBOL nmos 1360 288 M0
SYMATTR InstName M28
SYMATTR Value nch_tt
SYMATTR Value2 W=540n,L=180n
SYMBOL pmos 3040 -384 M180
SYMATTR InstName M29
SYMATTR Value pch_tt
SYMATTR Value2 W=720n,L=180n
SYMBOL pmos 3328 -384 R180
SYMATTR InstName M30
SYMATTR Value pch_tt
SYMATTR Value2 W=720n,L=180n
SYMBOL pmos 3040 -192 M180
SYMATTR InstName M31
SYMATTR Value pch_tt
SYMATTR Value2 W=1440n,L=180n
SYMBOL pmos 3040 -32 M180
SYMATTR InstName M32
SYMATTR Value pch_tt
SYMATTR Value2 W=1440n,L=180n
SYMBOL pmos 3328 -144 R180
SYMATTR InstName M33
SYMATTR Value pch_tt
SYMATTR Value2 W=720n,L=180n
SYMBOL pmos 3696 -528 M180
SYMATTR InstName M34
SYMATTR Value pch_tt
SYMATTR Value2 W=720n,L=180n
SYMBOL pmos 3952 -528 M180
SYMATTR InstName M35
SYMATTR Value pch_tt
SYMATTR Value2 W=720n,L=180n
SYMBOL pmos 4208 -528 M180
SYMATTR InstName M36
SYMATTR Value pch_tt
SYMATTR Value2 W=720n,L=180n
SYMBOL pmos 3840 -304 M180
SYMATTR InstName M37
SYMATTR Value pch_tt
SYMATTR Value2 W=270n,L=270n
SYMBOL pmos 4208 -336 R180
SYMATTR InstName M38
SYMATTR Value pch_tt
SYMATTR Value2 W=2160n,L=180n
SYMBOL pmos 4208 -192 R180
SYMATTR InstName M39
SYMATTR Value pch_tt
SYMATTR Value2 W=2160n,L=180n
SYMBOL pmos 4208 -48 R180
SYMATTR InstName M40
SYMATTR Value pch_tt
SYMATTR Value2 W=2160n,L=180n
SYMBOL pmos 4576 -64 M180
SYMATTR InstName M41
SYMATTR Value pch_tt
SYMATTR Value2 W=360n,L=180n
SYMBOL nmos 3040 112 R0
SYMATTR InstName M42
SYMATTR Value nch_tt
SYMATTR Value2 W=360n,L=180n
SYMBOL nmos 2944 288 R0
SYMATTR InstName M43
SYMATTR Value nch_tt
SYMATTR Value2 W=360n,L=180n
SYMBOL nmos 3152 288 R0
SYMATTR InstName M44
SYMATTR Value nch_tt
SYMATTR Value2 W=360n,L=180n
SYMBOL nmos 3408 112 M0
SYMATTR InstName M45
SYMATTR Value nch_tt
SYMATTR Value2 W=360n,L=180n
SYMBOL nmos 3424 288 M0
SYMATTR InstName M46
SYMATTR Value nch_tt
SYMATTR Value2 W=360n,L=180n
SYMBOL pmos 3552 192 M180
SYMATTR InstName M47
SYMATTR Value pch_tt
SYMATTR Value2 W=360n,L=180n
SYMBOL nmos 3552 272 R0
SYMATTR InstName M48
SYMATTR Value nch_tt
SYMATTR Value2 W=180n,L=180n
SYMBOL nmos 3904 112 R0
SYMATTR InstName M49
SYMATTR Value nch_tt
SYMATTR Value2 W=360n,L=180n
SYMBOL nmos 3776 272 R0
SYMATTR InstName M50
SYMATTR Value nch_tt
SYMATTR Value2 W=360n,L=180n
SYMBOL nmos 3920 272 R0
WINDOW 3 53 75 Left 2
SYMATTR InstName M51
SYMATTR Value nch_tt
SYMATTR Value2 W=360n,L=180n
SYMBOL nmos 4064 272 R0
SYMATTR InstName M52
SYMATTR Value nch_tt
SYMATTR Value2 W=360n,L=180n
SYMBOL nmos 4576 16 R0
SYMATTR InstName M53
SYMATTR Value nch_tt
SYMATTR Value2 W=180n,L=180n
SYMBOL nmos 4336 48 M0
SYMATTR InstName M54
SYMATTR Value nch_tt
SYMATTR Value2 W=540n,L=180n
SYMBOL nmos 4336 160 M0
SYMATTR InstName M55
SYMATTR Value nch_tt
SYMATTR Value2 W=540n,L=180n
SYMBOL nmos 4336 272 M0
SYMATTR InstName M56
SYMATTR Value nch_tt
SYMATTR Value2 W=540n,L=180n
SYMBOL pmos 6112 -448 M180
SYMATTR InstName M57
SYMATTR Value pch_tt
SYMATTR Value2 W=720n,L=180n
SYMBOL pmos 6400 -448 R180
SYMATTR InstName M58
SYMATTR Value pch_tt
SYMATTR Value2 W=720n,L=180n
SYMBOL pmos 6112 -256 M180
SYMATTR InstName M59
SYMATTR Value pch_tt
SYMATTR Value2 W=1440n,L=180n
SYMBOL pmos 6112 -96 M180
SYMATTR InstName M60
SYMATTR Value pch_tt
SYMATTR Value2 W=1440n,L=180n
SYMBOL pmos 6400 -208 R180
SYMATTR InstName M61
SYMATTR Value pch_tt
SYMATTR Value2 W=720n,L=180n
SYMBOL pmos 6768 -592 M180
SYMATTR InstName M62
SYMATTR Value pch_tt
SYMATTR Value2 W=720n,L=180n
SYMBOL pmos 7024 -592 M180
SYMATTR InstName M63
SYMATTR Value pch_tt
SYMATTR Value2 W=720n,L=180n
SYMBOL pmos 7280 -592 M180
SYMATTR InstName M64
SYMATTR Value pch_tt
SYMATTR Value2 W=720n,L=180n
SYMBOL pmos 6912 -368 M180
SYMATTR InstName M65
SYMATTR Value pch_tt
SYMATTR Value2 W=270n,L=270n
SYMBOL pmos 7280 -400 R180
SYMATTR InstName M66
SYMATTR Value pch_tt
SYMATTR Value2 W=2160n,L=180n
SYMBOL pmos 7280 -256 R180
SYMATTR InstName M67
SYMATTR Value pch_tt
SYMATTR Value2 W=2160n,L=180n
SYMBOL pmos 7280 -112 R180
SYMATTR InstName M68
SYMATTR Value pch_tt
SYMATTR Value2 W=2160n,L=180n
SYMBOL pmos 7648 -128 M180
SYMATTR InstName M69
SYMATTR Value pch_tt
SYMATTR Value2 W=360n,L=180n
SYMBOL nmos 6112 48 R0
SYMATTR InstName M70
SYMATTR Value nch_tt
SYMATTR Value2 W=360n,L=180n
SYMBOL nmos 6016 224 R0
SYMATTR InstName M71
SYMATTR Value nch_tt
SYMATTR Value2 W=360n,L=180n
SYMBOL nmos 6224 224 R0
SYMATTR InstName M72
SYMATTR Value nch_tt
SYMATTR Value2 W=360n,L=180n
SYMBOL nmos 6480 48 M0
SYMATTR InstName M73
SYMATTR Value nch_tt
SYMATTR Value2 W=360n,L=180n
SYMBOL nmos 6496 224 M0
SYMATTR InstName M74
SYMATTR Value nch_tt
SYMATTR Value2 W=360n,L=180n
SYMBOL pmos 6624 128 M180
SYMATTR InstName M75
SYMATTR Value pch_tt
SYMATTR Value2 W=360n,L=180n
SYMBOL nmos 6624 208 R0
SYMATTR InstName M76
SYMATTR Value nch_tt
SYMATTR Value2 W=180n,L=180n
SYMBOL nmos 6976 48 R0
SYMATTR InstName M77
SYMATTR Value nch_tt
SYMATTR Value2 W=360n,L=180n
SYMBOL nmos 6848 208 R0
SYMATTR InstName M78
SYMATTR Value nch_tt
SYMATTR Value2 W=360n,L=180n
SYMBOL nmos 6992 208 R0
WINDOW 3 53 75 Left 2
SYMATTR InstName M79
SYMATTR Value nch_tt
SYMATTR Value2 W=360n,L=180n
SYMBOL nmos 7136 208 R0
SYMATTR InstName M80
SYMATTR Value nch_tt
SYMATTR Value2 W=360n,L=180n
SYMBOL nmos 7648 -48 R0
SYMATTR InstName M81
SYMATTR Value nch_tt
SYMATTR Value2 W=180n,L=180n
SYMBOL nmos 7408 -16 M0
SYMATTR InstName M82
SYMATTR Value nch_tt
SYMATTR Value2 W=540n,L=180n
SYMBOL nmos 7408 96 M0
SYMATTR InstName M83
SYMATTR Value nch_tt
SYMATTR Value2 W=540n,L=180n
SYMBOL nmos 7408 208 M0
SYMATTR InstName M84
SYMATTR Value nch_tt
SYMATTR Value2 W=540n,L=180n
SYMBOL pmos 9152 -400 M180
SYMATTR InstName M85
SYMATTR Value pch_tt
SYMATTR Value2 W=720n,L=180n
SYMBOL pmos 9440 -400 R180
SYMATTR InstName M86
SYMATTR Value pch_tt
SYMATTR Value2 W=720n,L=180n
SYMBOL pmos 9152 -208 M180
SYMATTR InstName M87
SYMATTR Value pch_tt
SYMATTR Value2 W=1440n,L=180n
SYMBOL pmos 9152 -48 M180
SYMATTR InstName M88
SYMATTR Value pch_tt
SYMATTR Value2 W=1440n,L=180n
SYMBOL pmos 9440 -160 R180
SYMATTR InstName M89
SYMATTR Value pch_tt
SYMATTR Value2 W=720n,L=180n
SYMBOL pmos 9808 -544 M180
SYMATTR InstName M90
SYMATTR Value pch_tt
SYMATTR Value2 W=720n,L=180n
SYMBOL pmos 10064 -544 M180
SYMATTR InstName M91
SYMATTR Value pch_tt
SYMATTR Value2 W=720n,L=180n
SYMBOL pmos 10320 -544 M180
SYMATTR InstName M92
SYMATTR Value pch_tt
SYMATTR Value2 W=720n,L=180n
SYMBOL pmos 9952 -320 M180
SYMATTR InstName M93
SYMATTR Value pch_tt
SYMATTR Value2 W=270n,L=270n
SYMBOL pmos 10320 -352 R180
SYMATTR InstName M94
SYMATTR Value pch_tt
SYMATTR Value2 W=2160n,L=180n
SYMBOL pmos 10320 -208 R180
SYMATTR InstName M95
SYMATTR Value pch_tt
SYMATTR Value2 W=2160n,L=180n
SYMBOL pmos 10320 -64 R180
SYMATTR InstName M96
SYMATTR Value pch_tt
SYMATTR Value2 W=2160n,L=180n
SYMBOL pmos 10688 -80 M180
SYMATTR InstName M97
SYMATTR Value pch_tt
SYMATTR Value2 W=360n,L=180n
SYMBOL nmos 9152 96 R0
SYMATTR InstName M98
SYMATTR Value nch_tt
SYMATTR Value2 W=360n,L=180n
SYMBOL nmos 9056 272 R0
SYMATTR InstName M99
SYMATTR Value nch_tt
SYMATTR Value2 W=360n,L=180n
SYMBOL nmos 9264 272 R0
SYMATTR InstName M100
SYMATTR Value nch_tt
SYMATTR Value2 W=360n,L=180n
SYMBOL nmos 9520 96 M0
SYMATTR InstName M101
SYMATTR Value nch_tt
SYMATTR Value2 W=360n,L=180n
SYMBOL nmos 9536 272 M0
SYMATTR InstName M102
SYMATTR Value nch_tt
SYMATTR Value2 W=360n,L=180n
SYMBOL pmos 9664 176 M180
SYMATTR InstName M103
SYMATTR Value pch_tt
SYMATTR Value2 W=360n,L=180n
SYMBOL nmos 9664 256 R0
SYMATTR InstName M104
SYMATTR Value nch_tt
SYMATTR Value2 W=180n,L=180n
SYMBOL nmos 10016 96 R0
SYMATTR InstName M105
SYMATTR Value nch_tt
SYMATTR Value2 W=360n,L=180n
SYMBOL nmos 9888 256 R0
SYMATTR InstName M106
SYMATTR Value nch_tt
SYMATTR Value2 W=360n,L=180n
SYMBOL nmos 10032 256 R0
WINDOW 3 53 75 Left 2
SYMATTR InstName M107
SYMATTR Value nch_tt
SYMATTR Value2 W=360n,L=180n
SYMBOL nmos 10176 256 R0
SYMATTR InstName M108
SYMATTR Value nch_tt
SYMATTR Value2 W=360n,L=180n
SYMBOL nmos 10688 0 R0
SYMATTR InstName M109
SYMATTR Value nch_tt
SYMATTR Value2 W=180n,L=180n
SYMBOL nmos 10448 32 M0
SYMATTR InstName M110
SYMATTR Value nch_tt
SYMATTR Value2 W=540n,L=180n
SYMBOL nmos 10448 144 M0
SYMATTR InstName M111
SYMATTR Value nch_tt
SYMATTR Value2 W=540n,L=180n
SYMBOL nmos 10448 256 M0
SYMATTR InstName M112
SYMATTR Value nch_tt
SYMATTR Value2 W=540n,L=180n
SYMBOL voltage 4336 1088 R0
WINDOW 3 -189 153 Left 2
WINDOW 123 0 0 Left 0
WINDOW 39 0 0 Left 0
SYMATTR InstName V1
SYMATTR Value PULSE(0 2.5 0 1p 1p 0.5 1)
SYMBOL voltage 4528 1088 R0
WINDOW 123 0 0 Left 0
WINDOW 39 0 0 Left 0
SYMATTR InstName V2
SYMATTR Value PULSE(0 2.5 0.5 1p 1p 0.5 1)
SYMBOL voltage 4736 1088 R0
WINDOW 123 0 0 Left 0
WINDOW 39 0 0 Left 0
SYMATTR InstName V3
SYMATTR Value PULSE(0 2.5 0.5 1p 1p 0.5 1)
SYMBOL voltage 4976 1088 R0
WINDOW 123 0 0 Left 0
WINDOW 39 0 0 Left 0
SYMATTR InstName V4
SYMATTR Value PULSE(0 2.5 0 1p 1p 0.5 1)
SYMBOL voltage 5696 1088 R0
WINDOW 123 0 0 Left 0
WINDOW 39 0 0 Left 0
SYMATTR InstName V5
SYMATTR Value PULSE(0 2.5 0 1p 1p 0.5 1)
SYMBOL voltage 5824 1088 R0
WINDOW 123 0 0 Left 0
WINDOW 39 0 0 Left 0
SYMATTR InstName V6
SYMATTR Value PULSE(0 2.5 0.5m 1p 1p 0.5 1)
SYMBOL voltage 5968 1088 R0
WINDOW 123 0 0 Left 0
WINDOW 39 0 0 Left 0
SYMATTR InstName V7
SYMATTR Value PULSE(0 2.5 0 1p 1p 0.5 1)
SYMBOL voltage 6096 1088 R0
WINDOW 123 0 0 Left 0
WINDOW 39 0 0 Left 0
SYMATTR InstName V8
SYMATTR Value PULSE(0 2.5 0.5 1p 1p 0.5 1)
SYMBOL voltage 5248 1088 R0
WINDOW 123 0 0 Left 0
WINDOW 39 0 0 Left 0
SYMATTR InstName V9
SYMATTR Value 0
SYMBOL cap 2080 -880 R270
WINDOW 0 32 32 VTop 2
WINDOW 3 0 32 VBottom 2
SYMATTR InstName C1
SYMATTR Value 1p
SYMBOL cap 5040 -896 R270
WINDOW 0 32 32 VTop 2
WINDOW 3 0 32 VBottom 2
SYMATTR InstName C2
SYMATTR Value 1p
SYMBOL cap 8128 -832 R270
WINDOW 0 32 32 VTop 2
WINDOW 3 0 32 VBottom 2
SYMATTR InstName C3
SYMATTR Value 1p
SYMBOL cap 11184 -864 R270
WINDOW 0 32 32 VTop 2
WINDOW 3 0 32 VBottom 2
SYMATTR InstName C4
SYMATTR Value 1p
SYMBOL cap 2144 224 R0
SYMATTR InstName C5
SYMATTR Value 1p
SYMBOL cap 5392 208 R0
SYMATTR InstName C6
SYMATTR Value 1p
SYMBOL cap 7968 144 R0
SYMATTR InstName C7
SYMATTR Value 1p
SYMBOL cap 11040 192 R0
SYMATTR InstName C8
SYMATTR Value 1p
TEXT 5416 1440 Left 2 !.include TSMC180.lib
TEXT 5418 1364 Left 2 !.tran 10

The netlist it stands for:
* design_1.asc
M1 N016 A0 Vdd Vdd pch_tt W=720n,L=180n
M2 N016 B0 Vdd Vdd pch_tt W=720n,L=180n
M3 N031 B0 N016 N016 pch_tt W=1440n,L=180n
M4 N012 A0 N031 N031 pch_tt W=1440n,L=180n
M5 N012 Ci N016 N016 pch_tt W=720n,L=180n
M6 N007 Ci Vdd Vdd pch_tt W=720n,L=180n
M7 N007 A0 Vdd Vdd pch_tt W=720n,L=180n
M8 N007 B0 Vdd Vdd pch_tt W=720n,L=180n
M9 N029 N012 N007 N007 pch_tt W=270n,L=270n
M10 N019 A0 N007 N007 pch_tt W=2160n,L=180n
M11 N028 B0 N019 N019 pch_tt W=2160n,L=180n
M12 N029 Ci N028 N028 pch_tt W=2160n,L=180n
M13 S0 N029 Vdd Vdd pch_tt W=360n,L=180n
M14 N012 Ci N048 N048 nch_tt W=360n,L=180n
M15 N048 A0 N055 N055 nch_tt W=360n,L=180n
M16 N048 B0 N055 N055 nch_tt W=360n,L=180n
M17 N012 A0 N051 N051 nch_tt W=360n,L=180n
M18 N051 B0 N055 N055 nch_tt W=360n,L=180n
M19 N003 N012 Vdd Vdd pch_tt W=360n,L=180n
M20 N003 N012 N055 N055 nch_tt W=180n,L=180n
M21 N029 N012 N042 N042 nch_tt W=360n,L=180n
M22 N042 A0 0 0 nch_tt W=360n,L=180n
M23 N042 B0 0 0 nch_tt W=360n,L=180n
M24 N042 Ci 0 0 nch_tt W=360n,L=180n
M25 S0 N029 0 0 nch_tt W=180n,L=180n
M26 N029 Ci N035 N035 nch_tt W=540n,L=180n
M27 N035 A0 N049 N049 nch_tt W=540n,L=180n
M28 N049 B0 0 0 nch_tt W=540n,L=180n
M29 N015 A1 Vdd Vdd pch_tt W=720n,L=180n
M30 N015 B1 Vdd Vdd pch_tt W=720n,L=180n
M31 N030 B1 N015 N015 pch_tt W=1440n,L=180n
M32 N011 A1 N030 N030 pch_tt W=1440n,L=180n
M33 N011 N003 N015 N015 pch_tt W=720n,L=180n
M34 N006 N003 Vdd Vdd pch_tt W=720n,L=180n
M35 N006 A1 Vdd Vdd pch_tt W=720n,L=180n
M36 N006 B1 Vdd Vdd pch_tt W=720n,L=180n
M37 N026 N011 N006 N006 pch_tt W=270n,L=270n
M38 N018 A1 N006 N006 pch_tt W=2160n,L=180n
M39 N025 B1 N018 N018 pch_tt W=2160n,L=180n
M40 N026 N003 N025 N025 pch_tt W=2160n,L=180n
M41 S1 N026 Vdd Vdd pch_tt W=360n,L=180n
M42 N011 N003 N045 N045 nch_tt W=360n,L=180n
M43 N045 A1 N054 N054 nch_tt W=360n,L=180n
M44 N045 B1 N054 N054 nch_tt W=360n,L=180n
M45 N011 A1 N050 N050 nch_tt W=360n,L=180n
M46 N050 B1 N054 N054 nch_tt W=360n,L=180n
M47 N001 N011 Vdd Vdd pch_tt W=360n,L=180n
M48 N001 N011 N054 N054 nch_tt W=180n,L=180n
M49 N026 N011 N041 N041 nch_tt W=360n,L=180n
M50 N041 A1 0 0 nch_tt W=360n,L=180n
M51 N041 B1 0 0 nch_tt W=360n,L=180n
M52 N041 N003 0 0 nch_tt W=360n,L=180n
M53 S1 N026 0 0 nch_tt W=180n,L=180n
M54 N026 N003 N034 N034 nch_tt W=540n,L=180n
M55 N034 A1 N046 N046 nch_tt W=540n,L=180n
M56 N046 B1 0 0 nch_tt W=540n,L=180n
M57 N009 A2 Vdd Vdd pch_tt W=720n,L=180n
M58 N009 B2 Vdd Vdd pch_tt W=720n,L=180n
M59 N022 B2 N009 N009 pch_tt W=1440n,L=180n
M60 N008 A2 N022 N022 pch_tt W=1440n,L=180n
M61 N008 N001 N009 N009 pch_tt W=720n,L=180n
M62 N004 N001 Vdd Vdd pch_tt W=720n,L=180n
M63 N004 A2 Vdd Vdd pch_tt W=720n,L=180n
M64 N004 B2 Vdd Vdd pch_tt W=720n,L=180n
M65 N021 N008 N004 N004 pch_tt W=270n,L=270n
M66 N013 A2 N004 N004 pch_tt W=2160n,L=180n
M67 N020 B2 N013 N013 pch_tt W=2160n,L=180n
M68 N021 N001 N020 N020 pch_tt W=2160n,L=180n
M69 S2 N021 Vdd Vdd pch_tt W=360n,L=180n
M70 N008 N001 N037 N037 nch_tt W=360n,L=180n
M71 N037 A2 N052 N052 nch_tt W=360n,L=180n
M72 N037 B2 N052 N052 nch_tt W=360n,L=180n
M73 N008 A2 N039 N039 nch_tt W=360n,L=180n
M74 N039 B2 N052 N052 nch_tt W=360n,L=180n
M75 N002 N008 Vdd Vdd pch_tt W=360n,L=180n
M76 N002 N008 N052 N052 nch_tt W=180n,L=180n
M77 N021 N008 N036 N036 nch_tt W=360n,L=180n
M78 N036 A2 0 0 nch_tt W=360n,L=180n
M79 N036 B2 0 0 nch_tt W=360n,L=180n
M80 N036 N001 0 0 nch_tt W=360n,L=180n
M81 S2 N021 0 0 nch_tt W=180n,L=180n
M82 N021 N001 N032 N032 nch_tt W=540n,L=180n
M83 N032 A2 N038 N038 nch_tt W=540n,L=180n
M84 N038 B2 0 0 nch_tt W=540n,L=180n
M85 N014 A3 Vdd Vdd pch_tt W=720n,L=180n
M86 N014 B3 Vdd Vdd pch_tt W=720n,L=180n
M87 N027 B3 N014 N014 pch_tt W=1440n,L=180n
M88 N010 A3 N027 N027 pch_tt W=1440n,L=180n
M89 N010 N002 N014 N014 pch_tt W=720n,L=180n
M90 N005 N002 Vdd Vdd pch_tt W=720n,L=180n
M91 N005 A3 Vdd Vdd pch_tt W=720n,L=180n
M92 N005 B3 Vdd Vdd pch_tt W=720n,L=180n
M93 N024 N010 N005 N005 pch_tt W=270n,L=270n
M94 N017 A3 N005 N005 pch_tt W=2160n,L=180n
M95 N023 B3 N017 N017 pch_tt W=2160n,L=180n
M96 N024 N002 N023 N023 pch_tt W=2160n,L=180n
M97 S3 N024 Vdd Vdd pch_tt W=360n,L=180n
M98 N010 N002 N043 N043 nch_tt W=360n,L=180n
M99 N043 A3 N053 N053 nch_tt W=360n,L=180n
M100 N043 B3 N053 N053 nch_tt W=360n,L=180n
M101 N010 A3 N047 N047 nch_tt W=360n,L=180n
M102 N047 B3 N053 N053 nch_tt W=360n,L=180n
M103 Co N010 Vdd Vdd pch_tt W=360n,L=180n
M104 Co N010 N053 N053 nch_tt W=180n,L=180n
M105 N024 N010 N040 N040 nch_tt W=360n,L=180n
M106 N040 A3 0 0 nch_tt W=360n,L=180n
M107 N040 B3 0 0 nch_tt W=360n,L=180n
M108 N040 N002 0 0 nch_tt W=360n,L=180n
M109 S3 N024 0 0 nch_tt W=180n,L=180n
M110 N024 N002 N033 N033 nch_tt W=540n,L=180n
M111 N033 A3 N044 N044 nch_tt W=540n,L=180n
M112 N044 B3 0 0 nch_tt W=540n,L=180n
V1 A0 0 PULSE(0 2.5 0 1p 1p 0.5 1)
V2 A1 0 PULSE(0 2.5 0.5 1p 1p 0.5 1)
V3 A2 0 PULSE(0 2.5 0.5 1p 1p 0.5 1)
V4 A3 0 PULSE(0 2.5 0 1p 1p 0.5 1)
V5 B0 0 PULSE(0 2.5 0 1p 1p 0.5 1)
V6 B1 0 PULSE(0 2.5 0.5m 1p 1p 0.5 1)
V7 B2 0 PULSE(0 2.5 0 1p 1p 0.5 1)
V8 B3 0 PULSE(0 2.5 0.5 1p 1p 0.5 1)
V9 Ci 0 0
C1 S0 0 1p
C2 S1 0 1p
C3 S2 0 1p
C4 S3 0 1p
C5 N003 0 1p
C6 N001 0 1p
C7 N002 0 1p
C8 Co 0 1p
.model NMOS NMOS
.model PMOS PMOS
.lib standard.mos
.include TSMC180.lib
.tran 10
.backanno
.end